# Altium schematic sheet Sensors.SchDoc
size A4
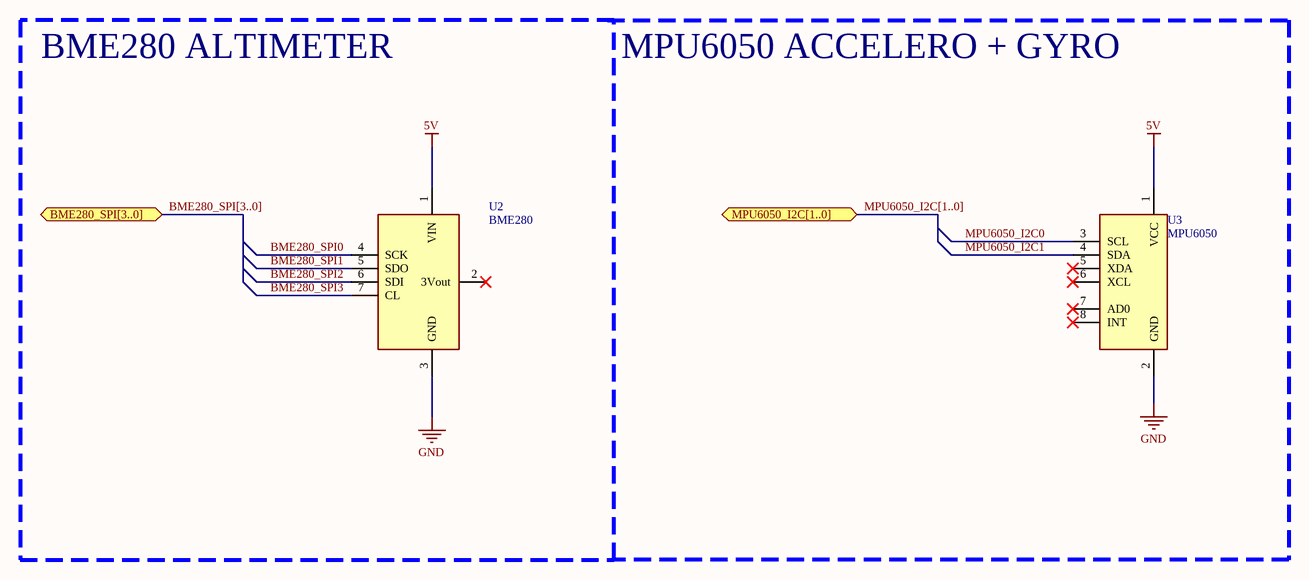
[diagram p0: Sensors.SchDoc]

## Parts
U2  BME280  [BME280]
U3  MPU6050  [MPU6050]

## Blocks framed on the sheet
BME280 ALTIMETER: U2

## Ports
BME280_SPI[3..0] (bidir), MPU6050_I2C[1..0] (bidir)

## Nets
5V: U2.1(VIN) U3.1(VCC)
GND: U2.3(GND) U3.2(GND)
BME280_SPI0: U2.4(SCK)
BME280_SPI1: U2.5(SDO)
BME280_SPI2: U2.6(SDI)
BME280_SPI3: U2.7(CL)
MPU6050_I2C0: U3.3(SCL)
MPU6050_I2C1: U3.4(SDA)

Not connected (* = marked no-connect by the designer): U2 2(3Vout)*; U3 5(XDA)* 6(XCL)* 7(AD0)* 8(INT)*

## Buses and harness runs
bus BME280_SPI[3..0] = port BME280_SPI[3..0]
bus MPU6050_I2C[1..0] = port MPU6050_I2C[1..0]

## Notes on the sheet
- MPU6050 ACCELERO + GYRO